# EAGLE design MinieasySens-RS485_V13-Build023 (EAGLE 9.3.0)
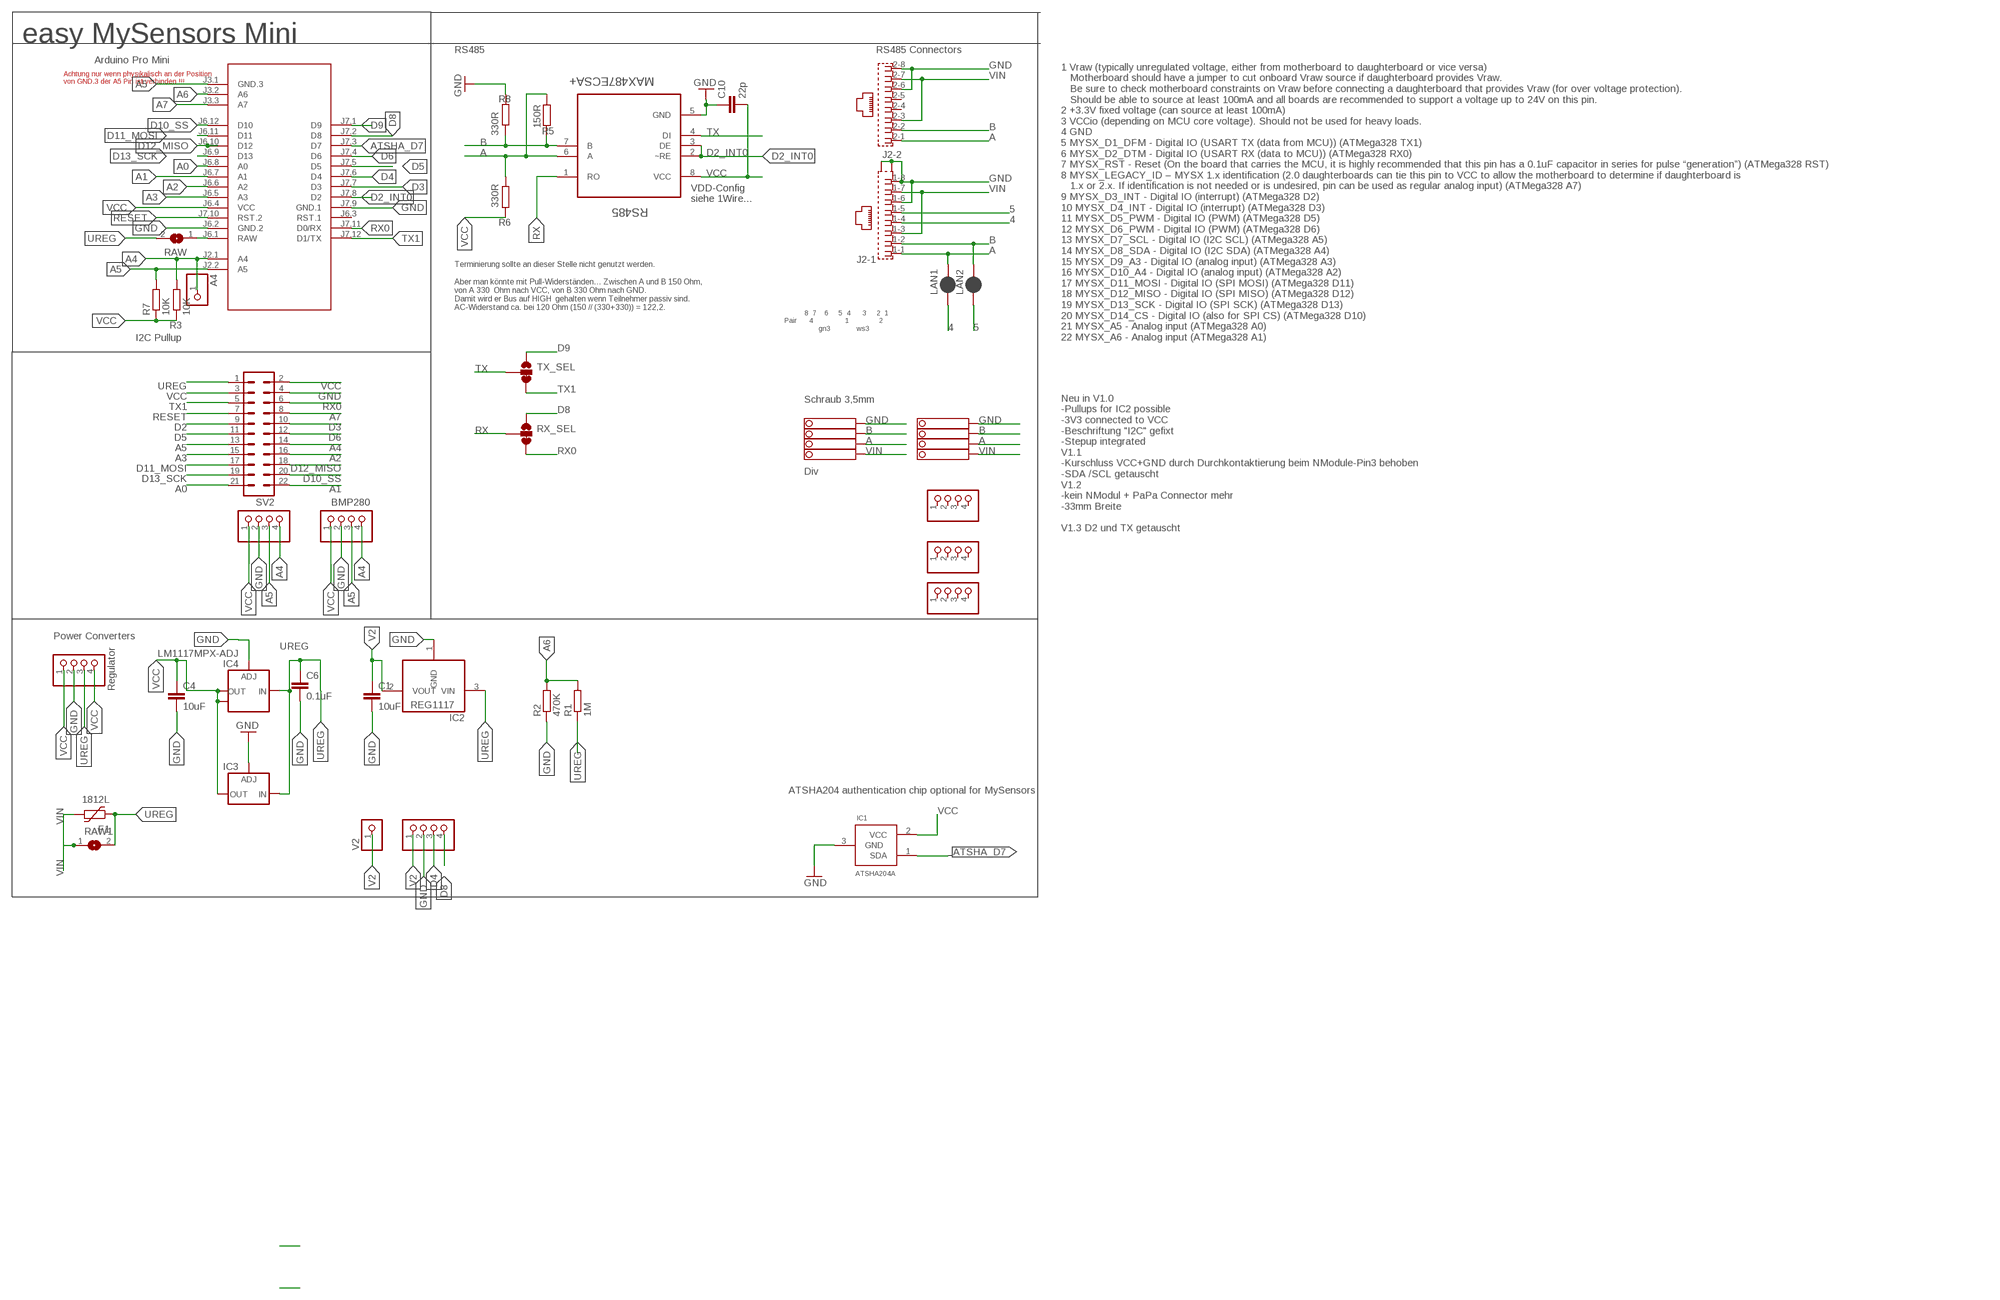
[diagram p0: schematic, sheet 1]

## Parts
A4  PINHD-1X1  [1X01]
BH1750  PINHD-1X04_2.54-S  [1X04-S]
C1  10uF  C-EUC1210  [C1210]
C4  10uF  C-EUC1210  [C1210]
C6  0.1uF  C-EUC1206  [C1206]
C10  22p  C-EUC0805  [C0805]
F1  1812L  [1812L]
I2C-1  PINHD-1X04_2.54-S  [1X04-S]
IC1  ATSHA204A  [SOT23]
IC2  REG1117  [SOT223]
IC3  LD117ADT50TR  [DPACK]
IC4  LM1117MPX-ADJ  [SOT223]
J2  RJ45_2X_NARROW_SHILDPINS_NOCASE  [RJ45_2X_NARROW_SHILDPINS_NOCASE]
JP1  PINHD-1X04_2.54-S  [1X04-S]
JP2  PINHD-1X04_2.54-S  [1X04-S]
JP4  PINHD-1X04_2.54-S  [1X04-S]
LAN1  JUMPER-SMT_2_NC_PASTE_SILK  [SMT-JUMPER_2_NC_PASTE_SILK]
LAN2  JUMPER-SMT_2_NC_PASTE_SILK  [SMT-JUMPER_2_NC_PASTE_SILK]
M1  ARDUINO-PRO-MINI-3.3V#NP  [ARDUINO-PRO-MINI#NP]
R1  1M  R-EU_R0805  [R0805]
R2  470K  R-EU_R0805  [R0805]
R3  10K  R-EU_R0805  [R0805]
R5  150R  R-EU_R0805  [R0805]
R6  330R  R-EU_R0805  [R0805]
R7  10K  R-EU_R0805  [R0805]
R8  330R  R-EU_R0805  [R0805]
RAW  SJ  [SJ]
RAW1  SJ  [SJ]
RS485  MAX487ECSA+  [SOIC127P600X175-8N]
RX_SEL  JUMPER-SMT_3_1-NC_TRACE_SILK  [SMT-JUMPER_3_1-NC_TRACE_SILK]
STEPDWN  PINHD-1X04_2.54-S  [1X04-S]
SV2  MA11-2  [MA11-2]
TX_SEL  JUMPER-SMT_3_1-NC_TRACE_SILK  [SMT-JUMPER_3_1-NC_TRACE_SILK]
V2  PINHD-1X1  [1X01]
V2-  PINHD-1X04_2.54-S  [1X04-S]
X1  1751264  [1751264]
X4  1751264  [1751264]

## Nets
4: J2.1-4 LAN1.1
5: J2.1-5 LAN2.1
A: J2.1-1 J2.2-1 LAN1.2 R5.1 R6.2 RS485.6(A) X1.2 X4.2
A0: M1.J6.8(A0) SV2.21
A1: M1.J6.7(A1) SV2.22
A2: M1.J6.6(A2) SV2.16
A3: M1.J6.5(A3) SV2.15
A4: A4.1 BH1750.4 I2C-1.4 M1.J2.1(A4) R3.2 SV2.14
A5: BH1750.3 I2C-1.3 M1.J2.2(A5) M1.J3.1(GND.3) R7.2 SV2.13
A6: M1.J3.2(A6) R1.2 R2.2
A7: M1.J3.3(A7) SV2.8
ATSHA_D7: IC1.1(SDA) M1.J7.3(D7)
B: J2.1-2 J2.2-2 LAN2.2 R5.2 R8.1 RS485.7(B) X1.3 X4.3
D2: SV2.9
D2_INT0: M1.J7.8(D2) RS485.2(~RE) RS485.3(DE)
D3: M1.J7.7(D3) SV2.10
D4: M1.J7.6(D4) V2-.3
D5: M1.J7.5(D5) SV2.11
D6: M1.J7.4(D6) SV2.12
D8: M1.J7.2(D8) RX_SEL.1 V2-.4
D9: M1.J7.1(D9) TX_SEL.1
D10_SS: M1.J6.12(D10) SV2.20
D11_MOSI: M1.J6.11(D11) SV2.17
D12_MISO: M1.J6.10(D12) SV2.18
D13_SCK: M1.J6.9(D13) SV2.19
GND [PWR]: BH1750.2 C1.2 C4.2 C6.2 C10.1 I2C-1.2 IC1.3(GND) IC2.1(GND) IC3.1(ADJ) IC4.1(ADJ) J2.1-6 J2.1-8 J2.2-6 J2.2-8 J2.G1(-1:S1) J2.G3(-1:S2) M1.J6.2(GND.2) M1.J7.9(GND.1) R2.1 R8.2 RS485.5(GND) STEPDWN.2 SV2.4 V2-.2 X1.4 X4.4
RAW [PWR]: M1.J6.1(RAW) RAW.1
RESET: M1.J7.10(RST.2) SV2.7
RX: RS485.1(RO) RX_SEL.2
RX0: M1.J7.11(D0/RX) RX_SEL.3 SV2.6
TX: RS485.4(DI) TX_SEL.2
TX1: M1.J7.12(D1/TX) SV2.5 TX_SEL.3
UREG [PWR]: C6.1 F1.P$1 IC2.3(VIN) IC3.3(IN) IC4.3(IN) R1.1 RAW1.2 RAW.2 STEPDWN.3 SV2.1
V2 [PWR]: C1.1 IC2.2(VOUT) V2-.1 V2.1
VCC [PWR]: BH1750.1 C4.1 C10.2 I2C-1.1 IC1.2(VCC) IC3.4(OUT) IC4.2(OUT) IC4.TAB(OUT1) M1.J6.4(VCC) R3.1 R6.1 R7.1 RS485.8(VCC) STEPDWN.1 STEPDWN.4 SV2.2 SV2.3
VIN [PWR]: F1.P$2 J2.1-3 J2.1-7 J2.2-3 J2.2-7 RAW1.1 X1.1 X4.1
Unconnected: J2.2-4 J2.2-5 JP1.1 JP1.2 JP1.3 JP1.4 JP2.1 JP2.2 JP2.3 JP2.4 JP4.1 JP4.2 JP4.3 JP4.4 M1.J6.3(RST.1)

## Notes on the sheet
- easy MySensors Mini
- RS485 | RS485 Connectors
- Arduino Pro Mini
- Achtung nur wenn physikalisch an der Position 
  von GND.3 der A5 Pin ist verbinden !!!
- VDD-Config
  siehe 1Wire...
- Terminierung sollte an dieser Stelle nicht genutzt werden.
  
  Aber man könnte mit Pull-Widerständen... Zwischen A und B 150 Ohm,
  von A 330  Ohm nach VCC, von B 330 Ohm nach GND. 
  Damit wird er Bus auf HIGH  gehalten wenn Teilnehmer passiv sind.
  AC-Widerstand ca. bei 120 Ohm (150 // (330+330)) = 122,2.
- 8  7    6     5  4      3     2  1
  Pair      4                1               2
                   gn3             ws3
- I2C Pullup
- 1 Vraw (typically unregulated voltage, either from motherboard to daughterboard or vice versa)
     Motherboard should have a jumper to cut onboard Vraw source if daughterboard provides Vraw. 
     Be sure to check motherboard constraints on Vraw before connecting a daughterboard that provides Vraw (for over voltage protection). 
     Should be able to source at least 100mA and all boards are recommended to support a voltage up to 24V on this pin.
  2 +3.3V fixed voltage (can source at least 100mA)
  3 VCCio (depending on MCU core voltage). Should not be used for heavy loads.
  4 GND
  5 MYSX_D1_DFM - Digital IO (USART TX (data from MCU)) (ATMega328 TX1)
  6 MYSX_D2_DTM - Digital IO (USART RX (data to MCU)) (ATMega328 RX0)
  7 MYSX_RST - Reset (On the board that carries the MCU, it is highly recommended that this pin has a 0.1uF capacitor in series for pulse “generation”) (ATMega328 RST)
  8 MYSX_LEGACY_ID – MYSX 1.x identification (2.0 daughterboards can tie this pin to VCC to allow the motherboard to determine if daughterboard is 
     1.x or 2.x. If identification is not needed or is undesired, pin can be used as regular analog input) (ATMega328 A7)
  9 MYSX_D3_INT - Digital IO (interrupt) (ATMega328 D2)
  10 MYSX_D4_INT - Digital IO (interrupt) (ATMega328 D3)
  11 MYSX_D5_PWM - Digital IO (PWM) (ATMega328 D5)
  12 MYSX_D6_PWM - Digital IO (PWM) (ATMega328 D6)
  13 MYSX_D7_SCL - Digital IO (I2C SCL) (ATMega328 A5)
  14 MYSX_D8_SDA - Digital IO (I2C SDA) (ATMega328 A4)
  15 MYSX_D9_A3 - Digital IO (analog input) (ATMega328 A3)
  16 MYSX_D10_A4 - Digital IO (analog input) (ATMega328 A2)
  17 MYSX_D11_MOSI - Digital IO (SPI MOSI) (ATMega328 D11)
  18 MYSX_D12_MISO - Digital IO (SPI MISO) (ATMega328 D12)
  19 MYSX_D13_SCK - Digital IO (SPI SCK) (ATMega328 D13)
  20 MYSX_D14_CS - Digital IO (also for SPI CS) (ATMega328 D10)
  21 MYSX_A5 - Analog input (ATMega328 A0)
  22 MYSX_A6 - Analog input (ATMega328 A1)
- Schraub 3,5mm
- Div
- BMP280
- Neu in V1.0
  -Pullups for IC2 possible
  -3V3 connected to VCC
  -Beschriftung "I2C" gefixt
  -Stepup integrated
  V1.1
  -Kurschluss VCC+GND durch Durchkontaktierung beim NModule-Pin3 behoben
  -SDA /SCL getauscht
  V1.2
  -kein NModul + PaPa Connector mehr
  -33mm Breite
  
  V1.3 D2 und TX getauscht
- Power Converters
- Regulator
- ATSHA204 authentication chip optional for MySensors

## Library data of the parts
A4 V2 = pinhead:PINHD-1X1: PIN HEADER
BH1750 I2C-1 JP1 JP2 JP4 STEPDWN V2- = pinhead-2:PINHD-1X04: PIN HEADER
C1 C4 C6 C10 = rcl:C-EU: CAPACITOR, European symbol
F1 = ptc-littlefuse:1812L
IC1 = Sensor:ATSHA204A
IC2 = burr-brown:REG1117: 800mA and 1A Low Dropout (LDO) Positive Regulator 1.8V, 2.5V, 2.85V, 3.3V, 5V, and Adj; MPN: REG1117; OC_FARNELL: 1097566; OC_NEWARK: 14P6981
IC3 = v-reg:LD117A?*: Low drop fixed and adjustable positive voltage regulators 1 A Source: http://www.st.com/stonline/products/literature/ds/7194/ld1117axx.pdf
IC4 = lm1117:LM1117MPX-ADJ
J2 = RJ45:RJ45_2X_NARROW_SHILDPINS_NOCASE: RJ45 connector
LAN1 LAN2 = SparkFun-Jumpers:JUMPER-SMT_2_NC_PASTE: Normally closed solder jumper This jumper has an aperture in the stencil to allow solder paste to bridge the split in the wire so it's normally closed (NC). Wick off the solder to open the connection. Reapply solder to reclose the connection.
M1 = diy-modules:ARDUINO-PRO-MINI-*#NP: Arduino Pro Mini without programming pads
R1-R3 R5-R8 = rcl:R-EU_: RESISTOR, European symbol
RAW RAW1 = jumper:SJ: SMD solder JUMPER
RS485 = Maxim_By_element14_Batch_1:MAX487ECSA+: Low-Power, Slew-Rate-Limited RS-485/RS-422 Transceivers; MPN: MAX487ECSA+; OC_FARNELL: 9724532; OC_NEWARK: 68K4803; PACKAGE: SOIC-8; SUPPLIER: Maxim
RX_SEL TX_SEL = SparkFun-Jumpers:JUMPER-SMT_3_1-NC_TRACE: Normally closed trace jumper (1 of 2 connections) This jumper has a trace between two pads so it's normally closed (NC). The other connection is normally open (NO). Use a razor knife to open the connection. For best results follow the IPC guidelines for cutting traces: Cutout at least 0.063 mm (0.005 in). Remove all loose material to clean up the cut area. Seal the cut with an approved epoxy. Reapply solder to reclose the connection, or to close the NO connection.
SV2 = con-Pinheader:MA11-2: PIN HEADER; OC_FARNELL: unknown; OC_NEWARK: unknown
X1 X4 = con-phoenix-350:1751264: MKDS 1/ 4-3,5 Printklemme Nennstrom: 10 A Bemessungsspannung: 160 V Raster: 3,5 mm Polzahl: 4 Montageart: Löten Anschlussart: Schraubanschluss Anschlussrichtung vom Leiter zur Platine: 0° Source: http://eshop.phoenixcontact.com .. 1751264.pdf; MPN: 1751264; OC_FARNELL: unknown; OC_NEWARK: 10R0934

## Net classes
0 default: width 0.254 mm, clearance 0.205 mm
1 PWR: width 0.406 mm, clearance 0.205 mm to class 0, clearance 0.205 mm

## Board
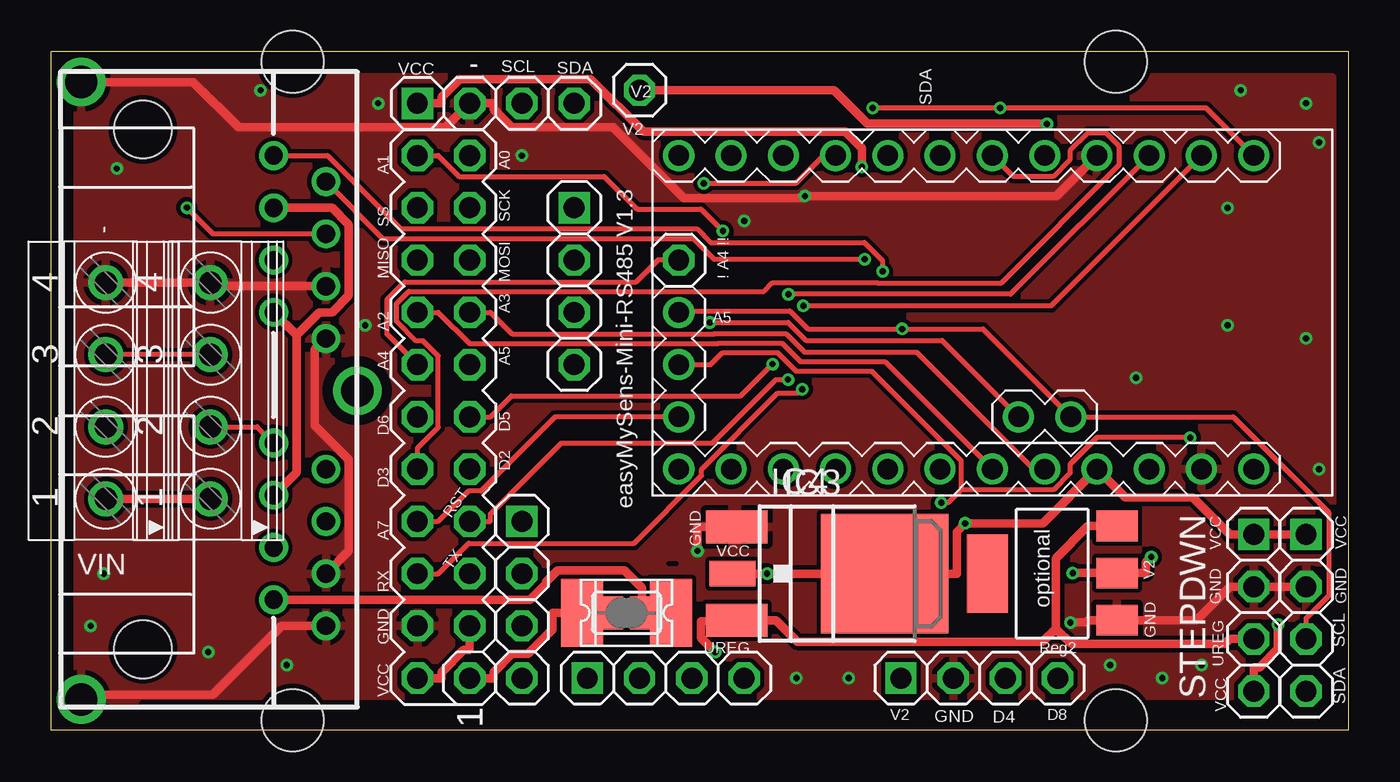
[diagram p1: board, top side]
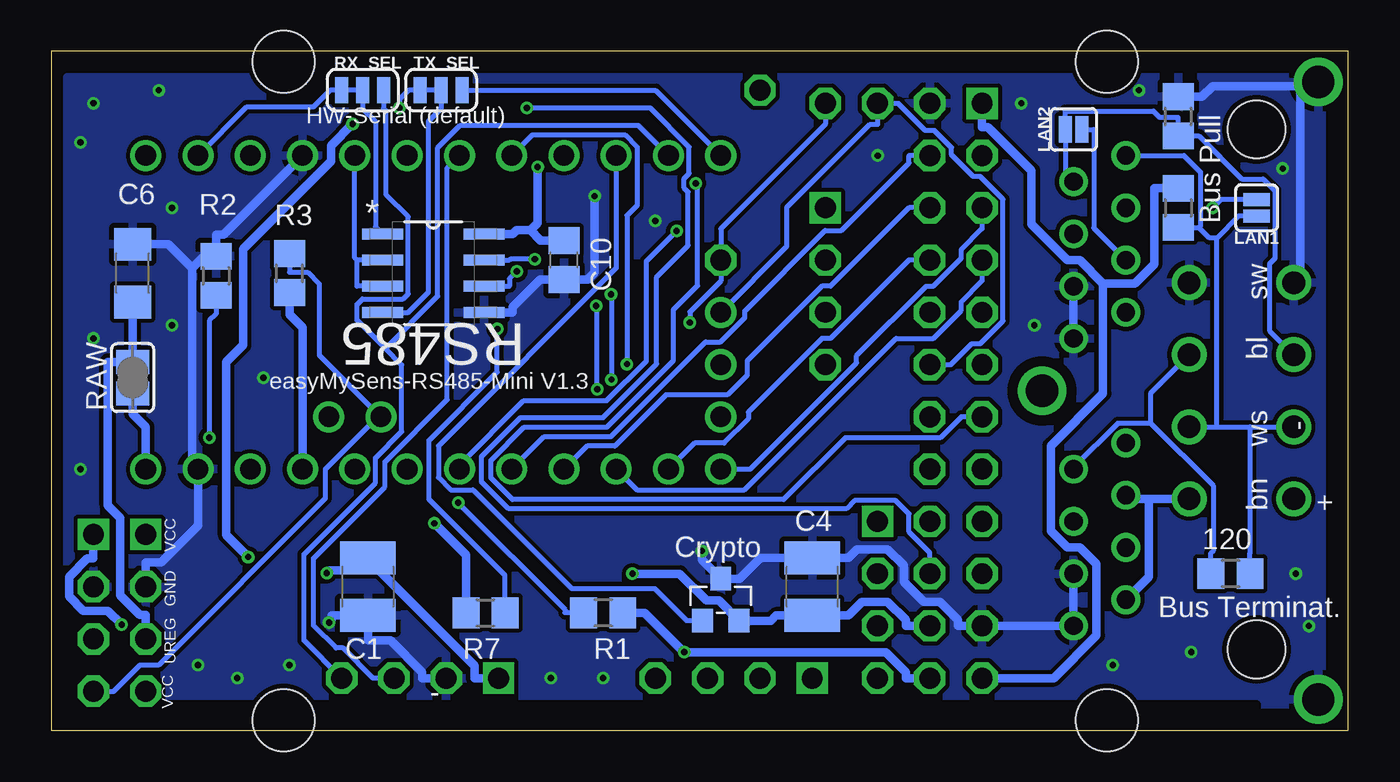
[diagram p2: board, bottom side, seen from below]

Size 63 x 33 mm. Coordinates in mm from the lower left corner, seen from the top.
Outline: 63,0 0,0 0,33 63,33 63,0
Copper layers (1*16): Top 0.035mm / dielectric 1.5mm / Bottom 0.035mm
Design rules "dirt_cheap_dirty_boards.v1": minimum track width 5mil, minimum drill 12mil, track to track 5mil, track to pad 5mil, pad to pad 5mil, via to via 5mil, smd to smd 0mil, copper to edge 10mil, drill to drill 10mil, minimum pad ring 10mil, minimum via ring 6mil, stop-mask expansion 2mil, vias tented up to drill 25mil, thermal gap 10mil
Holes 3 mm at 11.72,32.5 11.72,0.5 51.72,32.5 51.72,0.5
tRestrict: area 3.8,32.4 to 62.9,33; area 4.4,0 to 62.9,1.3; area 13.3,14.9 to 16.5,18.1; 2 lines
bRestrict: area 3.8,32.4 to 62.9,33; area 4.4,0 to 62.9,1.3; area 13.3,14.9 to 16.5,18.1; 2 lines

### Footprints (pad centres in the part's own frame; a part is rotated, then mirrored left to right if it is on the bottom)
1X01 = drill 1.016 octagon: 1 0,0
1X04-S = drill 1.016 square: 1 -3.81,0 | drill 1.016 octagon: 2 -1.27,0; 3 1.27,0; 4 3.81,0
C1210 = smd 1.6 x 2.7: 1 -1.4,0; 2 1.4,0
C1206 = smd 1.6 x 1.8: 1 -1.4,0; 2 1.4,0
C0805 = smd 1.3 x 1.5: 1 -0.95,0; 2 0.95,0
1812L = smd 2.03 x 3.3: P$1 -2.16,0; P$2 2.16,0
SOT23 = smd 1.016 x 1.143: 1 -0.889,-1.016; 2 0.889,-1.016; 3 0,1.016
SOT223 = smd 1.499 x 2.007: 1 -2.261,-3.15; 2 0.025,-3.15; 3 2.311,-3.15 | smd 3.81 x 2.007: 4 0,3.15
DPACK = smd 1.6 x 3: 1 -2.28,-4.8; 3 2.28,-4.8 | smd 5.8 x 6.2: 4 0,2.38
SOT223' = smd 1.219 x 2.235: 1 -2.311,-3.099; 2 0,-3.099; 3 2.311,-3.099 | smd 3.6 x 2.2: TAB 0,3.099
RJ45_2X_NARROW_SHILDPINS_NOCASE = drill 0.889: 1-1 -11.43,6.35; 1-2 -10.16,8.89; 1-3 -8.89,6.35; 1-4 -7.62,8.89; 1-5 -6.35,6.35; 1-6 -5.08,8.89; 1-7 -3.81,6.35; 1-8 -2.54,8.89; 2-1 2.54,6.35; 2-2 3.81,8.89; 2-3 5.08,6.35; 2-4 6.35,8.89; 2-5 7.62,6.35; 2-6 8.89,8.89; 2-7 10.16,6.35; 2-8 11.43,8.89 | drill 1.575 pad 2.184: G1 -15,-3; G2 0,10.414; G3 15,-3 | hole 2.8: -12.7,0; 12.573,0
SMT-JUMPER_2_NC_PASTE_SILK = smd 0.635 x 1.27: 1 -0.406,0; 2 0.406,0
ARDUINO-PRO-MINI#NP = drill 1: J2.1 -1.27,5.08; J2.2 -3.81,5.08; J3.1 15.24,0; J3.2 15.24,2.54; J3.3 15.24,5.08; J6.1 -12.7,7.62; J6.2 -10.16,7.62; J6.3 -7.62,7.62; J6.4 -5.08,7.62; J6.5 -2.54,7.62; J6.6 0,7.62; J6.7 2.54,7.62; J6.8 5.08,7.62; J6.9 7.62,7.62; J6.10 10.16,7.62; J6.11 12.7,7.62; J6.12 15.24,7.62; J7.1 15.24,-7.62; J7.2 12.7,-7.62; J7.3 10.16,-7.62; J7.4 7.62,-7.62; J7.5 5.08,-7.62; J7.6 2.54,-7.62; J7.7 0,-7.62; J7.8 -2.54,-7.62; J7.9 -5.08,-7.62; J7.10 -7.62,-7.62; J7.11 -10.16,-7.62; J7.12 -12.7,-7.62
R0805 = smd 1.3 x 1.5: 1 -0.95,0; 2 0.95,0
SJ = smd 1.168 x 1.6: 1 -0.762,0; 2 0.762,0
SOIC127P600X175-8N = smd 1.981 x 0.533: 1 -2.464,1.905; 2 -2.464,0.635; 3 -2.464,-0.635; 4 -2.464,-1.905; 5 2.464,-1.905; 6 2.464,-0.635; 7 2.464,0.635; 8 2.464,1.905
SMT-JUMPER_3_1-NC_TRACE_SILK = smd 0.635 x 1.27: 1 -1.016,0; 2 0,0; 3 1.016,0
MA11-2 = drill 1.016 octagon: 1 -12.7,-1.27; 2 -12.7,1.27; 3 -10.16,-1.27; 4 -10.16,1.27; 5 -7.62,-1.27; 6 -7.62,1.27; 7 -5.08,-1.27; 8 -5.08,1.27; 9 -2.54,-1.27; 10 -2.54,1.27; 11 0,-1.27; 12 0,1.27; 13 2.54,-1.27; 14 2.54,1.27; 15 5.08,-1.27; 16 5.08,1.27; 17 7.62,-1.27; 18 7.62,1.27; 19 10.16,-1.27; 20 10.16,1.27; 21 12.7,-1.27; 22 12.7,1.27
1751264 = drill 1.1 pad 1.7: 1 -5.25,-0.1; 2 -1.75,-0.1; 3 1.75,-0.1; 4 5.25,-0.1

### Placement (x,y rotation side)
A4  30.48,22.86 90 top
BH1750  21.59,30.48 0 top
C1  47.62,6.99 270 bottom
C4  26.04,6.99 90 bottom
C6  59.05,22.23 90 bottom
C10  38.1,22.86 90 bottom
F1  27.94,5.71 0 top
I2C-1  60.96,5.71 270 top
IC1  30.48,6.35 0 bottom
IC2  48.62,7.62 90 top
IC3  38.1,7.62 270 top
IC4  LM1117MPX-ADJ  [SOT223']  36.2,7.62 270 top
J2  4.45,16.51 270 top
JP1  22.86,6.35 270 top
JP2  29.84,2.54 0 top
JP4  25.4,21.59 270 top
LAN1  4.45,25.4 270 bottom
LAN2  13.34,29.21 180 bottom
M1  45.72,20.32 180 top
R1  36.2,5.71 180 bottom
R2  55,22.09 270 bottom
R3  51.44,22.23 90 bottom
R5  5.71,7.62 180 bottom
R6  8.26,25.4 270 bottom
R7  41.91,5.71 0 bottom
R8  8.26,29.84 90 bottom
RAW  59.05,17.14 90 bottom
RAW1  27.94,5.71 180 top
RS485  44.45,22.23 0 bottom
RX_SEL  47.88,31.11 180 bottom
STEPDWN  58.42,5.71 270 top
SV2  19.05,15.24 90 top
TX_SEL  44.07,31.11 180 bottom
V2  28.57,31.11 0 top
V2-  45.09,2.54 0 top
X1  2.54,16.51 90 top
X4  7.62,16.51 90 top

### Tracks (layer width: path | path; a pad name or v marks a point on that pad's centre or on a via)
4  (via drill 0.3 pad 0.61)
  Top 0.254: J2.1-4 7.85,24.13 v6.58,25.41
  Bottom 0.254: v6.58,25.41 6.18,25.81 5.33,25.81 LAN1.1
5
  Bottom 0.254: LAN2.1 12.36,29.21 12.36,24.42 J2.1-5
A  (via drill 0.3 pad 0.61)
  Top 0.254: J2.1-1 13.41,27.94 16.97,24.38 31.37,24.38 32.03,23.72 39.5,23.72 40.39,22.83 v40.39,22.31 | X4.2 10.01,14.76 J2.2-1
  Bottom 0.254: RS485.6 40.74,21.59 40.74,21.95 v40.39,22.31 | 4.76,14.76 X1.2 | 6.39,14.76 4.76,14.76 | 4.76,14.76 4.76,8.62 R5.1 | X4.2 6.39,14.76 | 6.39,14.76 6.39,23.94 | 6.39,23.94 6.74,23.94 7.25,24.45 | 6.39,23.94 5.33,24.99 LAN1.2 | J2.1-1 7.97,27.94 7.17,27.14 7.17,24.53 7.25,24.45 | R6.2 7.25,24.45
A0
  Bottom 0.254: M1.J6.8 39.06,14.28 35.82,14.28 31.21,18.89 30.48,18.89 29.31,20.06 29.31,20.39 25.41,24.29 24.62,24.29 21.34,27.57 21.34,27.94 SV2.21
A1  (via drill 0.3 pad 0.61)
  Top 0.254: v32.62,24.27 31.56,25.34 28.44,25.34 26.86,26.92 19.81,26.92 18.8,27.94 SV2.22
  Bottom 0.254: M1.J6.7 43.18,12.9 40.05,16.03 36.02,16.03 34.1,17.95 34.1,22.8 v32.62,24.27
A2
  Top 0.254: M1.J6.6 40.5,17.92 36.4,17.92 35.5,18.82 32.42,18.82 32.41,18.81 20.31,18.81 18.8,20.32 SV2.16
A3
  Top 0.254: M1.J6.5 47.71,12.7 42.03,18.38 36.59,18.38 35.69,19.28 32.23,19.28 32.22,19.27 22.39,19.27 21.34,20.32 SV2.15
A4  (via drill 0.3 pad 0.61)
  Top 0.254: v31.98,19.82 35.8,19.82 36.67,18.95 43.28,18.95 M1.J2.1 | A4.1 29.46,22.86 28.4,21.8 17.16,21.8 16.3,20.94 16.3,19.26 SV2.14
  Bottom 0.254: v31.98,19.82 31.98,20.34 30.48,21.84 A4.1 30.48,24.38 25.4,29.46 BH1750.4 | 47.07,15.32 M1.J2.1 | 47.07,15.32 49.98,18.23 49.98,21.7 50.56,22.27 51.44,22.27 R3.2 | 47.07,15.32 49.69,12.69 49.69,11.28 57.8,3.17 58.7,3.17 59.94,1.93 59.94,1.91 I2C-1.4
A5  (via drill 0.3 pad 0.61)
  Top 0.254: M1.J3.1 30.55,20.39 35.88,20.39 36.76,19.51 v41.34,19.51 45.26,19.51 M1.J2.2 57.42,15.24 62.06,10.6 62.06,6.53 60.99,5.46 60.96,5.46 I2C-1.3
  Bottom 0.254: R7.2 40.96,7.54 44.65,11.23 44.65,14.1 41.34,17.41 v41.34,19.51 | M1.J3.1 27.27,23.53 27.27,25.42 23.23,29.46 22.86,29.46 BH1750.3 21.84,30.48 21.84,30.45 20.55,29.16 20.1,29.16 19.27,28.32 19.27,27.98 18.21,26.92 17.87,26.92 16.76,25.82 16.76,19.9 17.87,18.8 18.29,18.8 19.3,17.78 SV2.13
A6  (via drill 0.3 pad 0.61)
  Top 0.254: 44.19,11.69 43.57,11.07 v43.24,11.07 | M1.J3.2 32.03,17.78 32.61,18.36 35.28,18.36 36.18,17.46 39.85,17.46 44.19,13.12 44.19,11.69 | v55.33,14.23 50.78,14.23 49.49,12.93 49.49,12.5 48.68,11.69 44.19,11.69 | 44.19,11.69
  Bottom 0.254: R2.2 55,20.24 55.33,19.91 v55.33,14.23 | R1.2 38.05,5.71 38.05,5.88 v43.24,11.07
A7
  Top 0.254: M1.J3.3 24.48,15.24 20.87,11.63 20.27,11.63 18.8,10.16 SV2.8
ATSHA_D7
  Bottom 0.254: IC1.1 32.13,5.33 33.7,6.9 37.72,6.9 42.52,11.69 43.6,11.69 44.19,12.28 44.19,13.83 35.56,22.46 M1.J7.3
B  (via drill 0.3 pad 0.61)
  Top 0.254: J2.1-2 16.09,23.91 31.18,23.91 32.19,22.9 v39.52,22.9 | X4.3 X1.3
  Bottom 0.254: RS485.7 40.74,22.86 40.7,22.9 v39.52,22.9 | R5.2 6.67,8.62 6.53,8.76 6.53,11.88 9.58,14.93 | 9.58,14.93 9.58,16.4 X4.3 | 9.58,14.93 11.19,14.93 13.34,12.79 J2.2-2 | J2.1-2 13.74,27.08 LAN2.2 13.74,29.66 13.74,30.1 9.46,30.1 9.16,29.8 8.26,29.8 R8.1 7.25,28.89 5.16,26.8 4.13,26.8 3.56,26.23 3.56,22.94 3.82,22.67 3.82,19.44 X1.3
D2_INT0
  Bottom 0.254: 48.16,22.86 48.26,22.96 M1.J7.8 | 48.16,22.86 48.04,22.86 RS485.2 | RS485.3 48.16,21.59 48.16,22.86
D3
  Top 0.254: M1.J7.7 46.73,26.93 48.67,26.93 49.49,27.74 49.49,28.17 50.35,29.03 51.25,29.03 51.89,28.39 51.89,27.49 46.14,21.75 40.16,21.75 40.15,21.75 35.03,21.75 34.62,21.34 17.36,21.34 16.76,20.74 16.76,19.89 17.72,18.93 18.07,18.93 18.8,18.2 18.8,14.73 17.78,13.72 SV2.10
D4
  Bottom 0.254: V2-.3 47.37,2.54 48.84,4 49.18,4 50.27,5.09 50.27,8.37 46.79,11.84 46.79,13.06 43.77,16.08 43.77,27.35 M1.J7.6
D5  (via drill 0.3 pad 0.61)
  Top 0.254: v35.03,17.8 33.49,16.26 22.35,16.26 21.34,15.24 SV2.11
  Bottom 0.254: M1.J7.5 39.63,28.95 35.14,28.95 34.55,28.36 34.55,25.52 35.03,25.03 v35.03,17.8
D6  (via drill 0.3 pad 0.61)
  Top 0.254: v31.7,26.59 36.17,26.59 37.52,27.94 M1.J7.4
  Bottom 0.254: v31.7,26.59 31.6,26.5 31.6,21.62 32.78,20.45 32.78,17.97 36.01,14.74 40.03,14.74 41.65,13.12 41.65,12.28 40.6,11.23 27.42,11.23 24.42,14.22 19.81,14.22 18.8,15.24 SV2.12
D8
  Bottom 0.254: 46.77,18.56 44.23,21.1 44.23,28.32 43.14,29.41 34.49,29.41 M1.J7.2 | V2-.4 50.73,4.37 50.73,8.56 47.25,12.04 47.25,13.25 45.98,14.52 45.98,17.76 46.77,18.56 | 46.77,18.56 48.16,19.94 48.16,20.7 47.89,20.97 45.91,20.97 45.67,21.21 45.67,24.96 46.73,26.02 46.73,30.09 46.86,30.23 RX_SEL.1
D9
  Bottom 0.254: M1.J7.1 33.66,31.11 42.48,31.11 TX_SEL.1
D10_SS
  Bottom 0.254: M1.J6.12 29.04,12.7 23.88,17.87 23.88,18.21 20.5,21.59 20.15,21.59 18.8,22.95 18.8,23.37 17.78,24.38 SV2.20
D11_MOSI
  Bottom 0.254: M1.J6.11 31.75,13.97 30.32,13.97 29.14,15.14 29.14,15.47 25.57,19.05 25.15,19.05 21.34,22.86 SV2.17
D12_MISO
  Bottom 0.254: M1.J6.10 34.55,11.69 29.33,11.69 21.97,19.05 20.15,19.05 18.8,20.41 18.8,20.83 17.78,21.84 SV2.18
D13_SCK
  Bottom 0.254: SV2.19 21.34,25.4 25.15,21.59 25.57,21.59 29.2,17.96 29.2,17.26 30.16,16.3 33.15,16.3 35.63,13.82 36.98,13.82 M1.J6.9
GND  (via drill 0.3 pad 0.61)
  Top 0.406: J2.1-6 7.89,21.59 X4.4 X1.4 | J2.G1 6.89,31.51 9.09,29.31 19.15,29.31 BH1750.2 21.49,30.48 21.49,30.19 22.37,29.31 27.3,29.31 30.73,25.88 36.51,25.88 v36.61,25.97 48.83,25.97 M1.J7.9 | v31.39,8.72 31.39,9.9 IC3.1 33.27,9.93 IC4.1 | J2.2-6 14.44,8.73 14.44,13.16 12.79,14.82 12.79,18.5 J2.1-8 | v49.51,5.24 50.25,5.24 50.36,5.36 IC2.1 55.62,5.36 57.25,6.99 STEPDWN.2 I2C-1.2 | J2.G3 1.67,1.73 7.83,1.73 11.18,5.08 J2.2-8
  Bottom 0.406: 2.33,31.32 6.57,31.32 7.1,30.8 R8.2 | J2.G1 1.63,31.32 2.33,31.32 | X1.4 2.33,22.07 2.33,31.32 | M1.J7.9 54.64,24.1 55,24.1 R2.1 55.58,23.05 56.16,22.47 | v36.61,25.97 36.61,22.24 36.94,21.91 C10.1 39.26,21.91 40.59,20.58 40.59,20.32 RS485.5 | v49.51,5.24 49.38,5.37 49.38,5.58 C1.2 47.62,4.38 46.53,4.38 44.98,2.83 44.98,2.54 V2-.2 | v31.39,8.72 31.39,8.28 IC1.3 30.16,7.37 29.56,7.37 28.55,8.38 27.79,8.38 C4.2 24.28,8.38 23.87,8.79 22.37,8.79 21.59,8.01 21.59,7.23 20.61,6.25 19.83,6.25 18.95,5.37 18.95,5.08 SV2.4 16.61,5.08 J2.2-8 J2.2-6 | J2.1-6 J2.1-8 | STEPDWN.2 58.42,8.15 57.68,8.15 55.88,9.96 M1.J6.2 56.16,12.98 56.16,22.47 | 56.16,22.47 57.32,23.62 C6.2
  other vias: 7.62,3.81 1.91,5.08 2.54,7.62 3.17,27.3 10.16,31.11 15.88,30.48 15.24,19.68 22.86,27.94 36.2,2.54 38.73,2.54 33.66,24.77 51.44,3.17 53.98,2.54 55.88,3.17 61.59,12.7 61.59,28.57 57.15,25.4 57.15,19.68 52.7,17.14 60.96,30.48 57.78,31.11 60.96,19.05 11.43,3.17
  pour Top: 1.27,1.27 1.27,31.75 62.23,31.75 62.23,1.27
  pour Bottom: 1.27,1.27 1.27,31.75 62.23,31.75 62.23,1.27
RAW
  Bottom 0.406: RAW.1 59.05,15.39 58.42,14.76 M1.J6.1
RESET  (via drill 0.3 pad 0.61)
  Top 0.254: v35.79,17.05 35.19,17.05 32.11,13.97 24.78,13.97 21.34,10.53 21.34,10.16 SV2.7 | M1.J7.10 46.6,21.2 v35.81,21.2
  Bottom 0.254: v35.81,21.2 35.79,21.17 v35.79,17.05
RX
  Bottom 0.254: RX_SEL.2 47.88,30.23 47.25,29.6 47.25,24.47 RS485.1
RX0  (via drill 0.3 pad 0.61)
  Top 0.254: v36.48,16.59 36.29,16.39 35.28,16.39 31.59,12.69 31.59,12.38 28.3,9.1 20.27,9.1 18.8,7.62 SV2.6 | M1.J7.11 48.57,20.63 v36.53,20.63
  Bottom 0.254: v36.48,16.59 36.48,20.58 v36.53,20.63 | M1.J7.11 53.51,30.31 50.27,30.31 49.47,31.11 RX_SEL.3
TX
  Bottom 0.254: RS485.4 45.67,20.32 44.69,21.3 44.69,29.61 44.07,30.23 TX_SEL.2
TX1  (via drill 0.3 pad 0.61)
  Top 0.254: v39.9,30.25 v46.09,30.25 56.11,30.25 M1.J7.12
  Bottom 0.254: v39.9,30.25 33.9,30.25 32.01,28.36 32.01,27.07 32.26,26.82 32.26,26.36 32.06,26.17 32.06,23.57 33.59,22.04 33.59,17.81 36.2,15.2 40.22,15.2 42.11,13.31 42.11,12.09 40.79,10.77 24.38,10.77 23.97,11.18 21.99,11.18 21.34,10.52 21.34,9.65 20.32,8.64 SV2.5 | v46.09,30.25 46.09,30.68 45.66,31.11 TX_SEL.3
UREG  (via drill 0.3 pad 0.61)
  Top 0.406: 48.8,4.95 48.16,4.31 36.24,4.31 35.21,5.34 IC3.3 33.13,5.34 IC4.3 31.57,5.31 31.57,4.49 v32.25,3.81 | 48.8,4.95 49.55,4.2 57,4.2 57.25,4.45 STEPDWN.3 | 48.8,4.95 48.8,8.37 50.36,9.93 IC2.3 | RAW1.2 F1.P$1 24.36,5.71 24.36,4.92 23.15,3.71 22.37,3.71 21.49,2.83 21.49,2.54 SV2.1
  Bottom 0.406: STEPDWN.3 58.42,5.62 58.71,5.62 59.65,6.56 59.65,10.32 60.26,10.93 60.26,17.91 RAW.2 C6.1 | R1.1 34.19,5.71 32.28,3.81 v32.25,3.81 22.46,3.81 21.49,2.83 21.49,2.54 SV2.1
V2  (via drill 0.3 pad 0.61)
  Top 0.406: v49.63,7.64 50.36,7.64 IC2.2 53.19,7.64 53.19,8.17 v53.44,8.43 | v48.37,29.48 39.65,29.48 38.02,31.11 29.75,31.11 V2.1
  Bottom 0.406: 47.62,7.78 49.49,7.78 v49.63,7.64 | 47.62,7.78 47.09,7.78 42.45,3.14 42.45,2.54 V2-.1 | v53.44,8.43 54.51,9.49 54.51,17.9 53.69,18.72 53.69,23.4 49.42,27.67 49.42,28.43 v48.37,29.48 | C1.1 47.62,7.78
VCC  (via drill 0.3 pad 0.61)
  Top 0.406: IC4.2 34.62,7.62 v34.77,7.62 38.13,7.62 IC4.TAB IC3.4 43.99,7.62 43.99,9.66 v44.4,10.06 | BH1750.1 18.95,30.48 18.95,30.77 19.83,31.66 26.2,31.66 28.76,29.1 38.58,29.1 39.38,28.3 v39.38,27.39 | v44.4,10.06 48.16,10.06 M1.J6.4 52.17,11.33 55.45,11.33 57.25,9.53 STEPDWN.1 I2C-1.1 | v44.4,10.06 | v59.59,5.15 59.59,3.96 58.71,3.08 58.42,3.08 STEPDWN.4 | SV2.2 18.95,2.54 18.95,2.83 20.03,3.91 20.32,3.91 SV2.3
  Bottom 0.406: v34.77,7.62 32.47,7.62 31.17,6.31 30.57,6.31 IC1.2 28.04,5.33 27.79,5.58 C4.1 24.28,5.58 23.61,6.25 22.37,6.25 21.49,5.37 21.49,5.08 SV2.3 | 39.73,24.31 39.38,24.66 v39.38,27.39 | 39.73,24.31 39.26,23.84 39.26,23.81 C10.2 | 39.73,24.31 40.41,24.31 40.59,24.13 RS485.8 | R3.1 51.44,20.22 50.8,19.58 M1.J6.4 | v59.59,5.15 60.26,5.82 61.45,5.82 62.13,6.5 62.13,7.47 61.25,8.36 60.96,8.36 I2C-1.1 | v44.4,10.06 42.86,8.53 R7.1 | SV2.2 14.3,2.54 12.23,4.62 12.23,8.09 13.03,8.89 13.64,8.89 14.45,9.7 14.45,13.83 11.9,16.38 11.9,21.72 | 11.9,21.72 10.36,21.72 9.41,22.67 9.41,26.35 R6.1 | 11.9,21.72 13.04,22.86 13.63,22.86 15.39,24.61 15.39,27.21 17.49,29.31 17.78,29.31 BH1750.1
VIN
  Top 0.406: J2.2-7 23.25,6.35 24.03,7.13 24.03,7.21 24.59,7.77 27.85,7.77 28.7,6.92 RAW1.1 F1.P$2 | 11.9,19.21 J2.1-7 | J2.2-3 11.9,12.54 11.9,19.21 | 11.9,19.21 13.01,20.32 13.63,20.32 14.45,21.13 14.45,24.59 13.63,25.4 J2.1-3 | X1.1 X4.1
  Bottom 0.406: 9.68,11.26 10.62,11.26 J2.2-3 | X4.1 9.68,11.26 | 9.68,11.26 9.68,7.46 J2.2-7

### Text on the board
tPlace: A0 | A1 | SCK | easyMySens-Mini-RS485 V1.3 | SS | MOSI | MISO | ! A4 !! | A3 | A5 | A2 | A5 | A4 | D5 | D6 | D2 | D3 | GND | RST | optional | VCC | VCC | A7 | VCC | TX | GND | GND | RX | V2 | GND | UREG | GND | UREG | Reg2 | VCC | VCC | V2 | D8
bPlace: easyMySens-RS485-Mini V1.3 | VCC | GND | UREG | VCC
tNames: - | SCL | VCC | SDA | V2 | V2 | SDA | - | VIN | SCL | GND | SDA | D4
bNames: Bus Pull | HW-Serial (default) | C6 | R3 | R2 | C10 | sw | bl | RAW | ws | - | + | bn | C4 | 120 | Crypto | Bus Terminat. | R1 | R7 | C1 | -
tValues: Gehäuse: RND 455‑00307